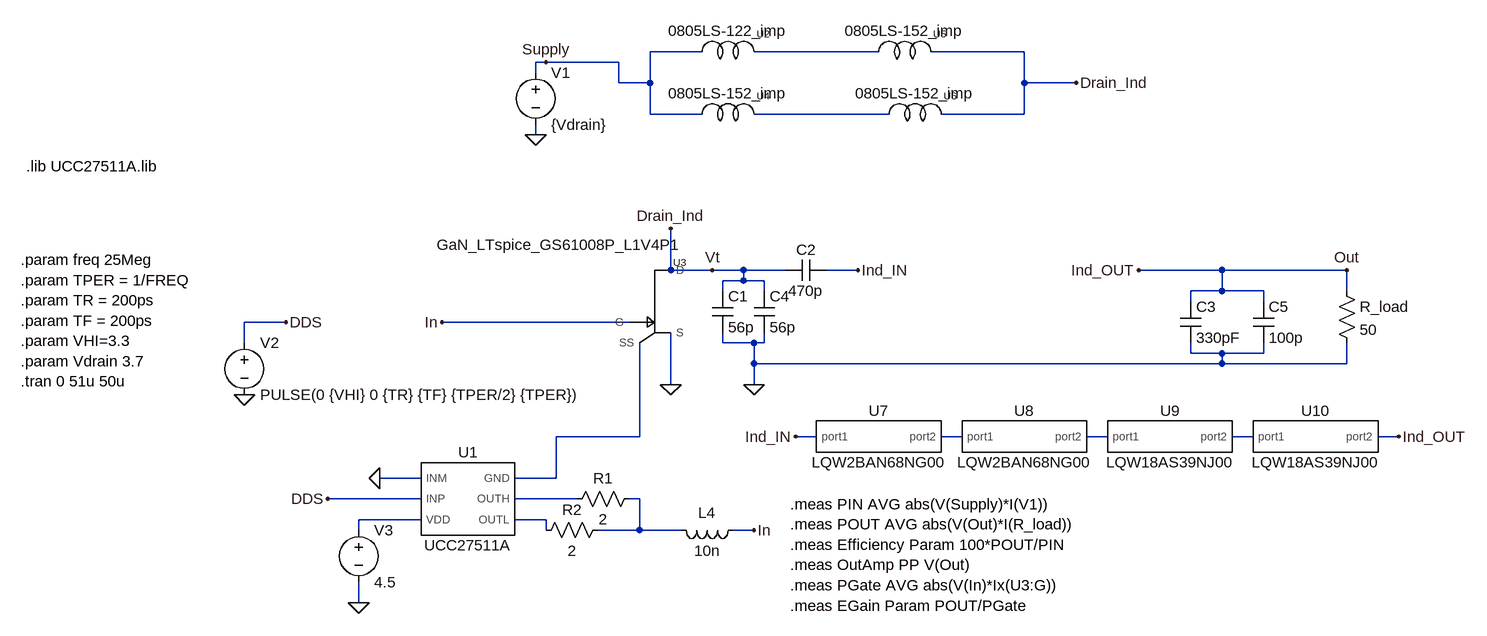
[diagram p0: schematic Class_E_TB.asc]
Class_E_TB.asc, the LTspice schematic file:
Version 4.1
SHEET 1 1384 800
WIRE 192 -208 112 -208
WIRE 464 -208 272 -208
WIRE 688 -208 544 -208
WIRE -48 -192 -64 -192
WIRE 64 -192 -48 -192
WIRE -64 -176 -64 -192
WIRE 64 -160 64 -192
WIRE 112 -160 112 -208
WIRE 112 -160 64 -160
WIRE 688 -160 688 -208
WIRE 768 -160 688 -160
WIRE 112 -112 112 -160
WIRE 192 -112 112 -112
WIRE 480 -112 272 -112
WIRE 688 -112 688 -160
WIRE 688 -112 560 -112
WIRE -64 -80 -64 -96
WIRE 144 128 144 64
WIRE 208 128 144 128
WIRE 256 128 208 128
WIRE 320 128 256 128
WIRE 432 128 384 128
WIRE 992 128 864 128
WIRE 1184 128 992 128
WIRE 256 144 256 128
WIRE 256 144 224 144
WIRE 288 144 256 144
WIRE 224 160 224 144
WIRE 288 160 288 144
WIRE 992 160 992 128
WIRE 992 160 944 160
WIRE 1056 160 992 160
WIRE 1184 160 1184 128
WIRE 944 176 944 160
WIRE 1056 176 1056 160
WIRE -448 208 -512 208
WIRE 80 208 -208 208
WIRE -512 240 -512 208
WIRE 224 240 224 224
WIRE 272 240 224 240
WIRE 288 240 288 224
WIRE 288 240 272 240
WIRE 944 256 944 240
WIRE 992 256 944 256
WIRE 1056 256 1056 240
WIRE 1056 256 992 256
WIRE 272 272 272 240
WIRE 992 272 992 256
WIRE 992 272 272 272
WIRE 1184 272 1184 240
WIRE 1184 272 992 272
WIRE 144 304 144 224
WIRE 272 304 272 272
WIRE 96 384 96 240
WIRE 96 384 -32 384
WIRE 368 384 336 384
WIRE 592 384 560 384
WIRE 816 384 784 384
WIRE 1040 384 1008 384
WIRE 1264 384 1232 384
WIRE -240 448 -304 448
WIRE -32 448 -32 384
WIRE -32 448 -96 448
WIRE -240 480 -384 480
WIRE 0 480 -96 480
WIRE 96 480 80 480
WIRE -240 512 -336 512
WIRE -48 512 -96 512
WIRE -336 528 -336 512
WIRE -48 528 -48 512
WIRE 96 528 96 480
WIRE 96 528 32 528
WIRE 160 528 96 528
WIRE 272 528 240 528
WIRE -336 640 -336 608
FLAG -64 -80 0
FLAG -512 320 0
FLAG 272 304 0
FLAG -208 208 In
FLAG 208 128 Vt
FLAG -48 -192 Supply
FLAG 144 304 0
FLAG 1184 128 Out
FLAG -448 208 DDS
FLAG -304 448 0
FLAG -384 480 DDS
FLAG 272 528 In
FLAG -336 640 0
FLAG 768 -160 Drain_Ind
FLAG 144 64 Drain_Ind
FLAG 336 384 Ind_IN
FLAG 1264 384 Ind_OUT
FLAG 432 128 Ind_IN
FLAG 864 128 Ind_OUT
SYMBOL voltage -64 -192 R0
WINDOW 123 0 0 Left 0
WINDOW 39 0 0 Left 0
SYMATTR InstName V1
SYMATTR Value {Vdrain}
SYMBOL voltage -512 224 R0
WINDOW 123 0 0 Left 0
WINDOW 39 0 0 Left 0
SYMATTR InstName V2
SYMATTR Value PULSE(0 {VHI} 0 {TR} {TF} {TPER/2} {TPER})
SYMBOL cap 384 112 R90
WINDOW 0 0 32 VBottom 2
WINDOW 3 32 32 VTop 2
SYMATTR InstName C2
SYMATTR Value 470p
SYMATTR SpiceLine V=50 Irms=2.20811 Rser=0.0430702 Lser=294.083p mfg="Vishay" pn="VJ0603D471KXXAJ" type="COG"
SYMBOL cap 208 160 R0
SYMATTR InstName C1
SYMATTR Value 56p
SYMATTR SpiceLine V=50 Irms=0 Rser=0 Lser=0
SYMBOL cap 928 176 R0
SYMATTR InstName C3
SYMATTR Value 330pF
SYMATTR SpiceLine V=50V
SYMBOL res 1168 144 R0
SYMATTR InstName R_load
SYMATTR Value 50
SYMBOL UCC27511A -176 480 R0
SYMATTR InstName U1
SYMBOL voltage -336 512 R0
WINDOW 123 0 0 Left 0
WINDOW 39 0 0 Left 0
SYMATTR InstName V3
SYMATTR Value 4.5
SYMBOL res 96 464 R90
WINDOW 0 0 56 VBottom 2
WINDOW 3 32 56 VTop 2
SYMATTR InstName R1
SYMATTR Value 2
SYMBOL res 48 512 R90
WINDOW 0 0 56 VBottom 2
WINDOW 3 32 56 VTop 2
SYMATTR InstName R2
SYMATTR Value 2
SYMBOL ind 256 512 R90
WINDOW 0 5 56 VBottom 2
WINDOW 3 32 56 VTop 2
SYMATTR InstName L4
SYMATTR Value 10n
SYMBOL GaN_LTspice_GS61008P_L1V4P1 96 176 R0
SYMATTR InstName U3
SYMBOL cap 272 160 R0
SYMATTR InstName C4
SYMATTR Value 56p
SYMATTR SpiceLine V=50 Irms=0 Rser=0 Lser=0
SYMBOL cap 1040 176 R0
SYMATTR InstName C5
SYMATTR Value 100p
SYMATTR SpiceLine V=50 Irms=20.8m Rser=5.448 Lser=0 mfg="KEMET" pn="C0603C101K5RAC" type="X7R"
SYMBOL LQW2BAN68NG00 464 384 R0
SYMATTR InstName U7
SYMBOL LQW2BAN68NG00 688 384 R0
SYMATTR InstName U8
SYMBOL LQW18AS39NJ00 912 384 R0
SYMATTR InstName U9
SYMBOL LQW18AS39NJ00 1136 384 R0
SYMATTR InstName U10
SYMBOL Coilcraft\\0805LS 192 -208 R0
SYMATTR SpiceModel 0805LS-122_imp
SYMATTR InstName U2
SYMBOL Coilcraft\\0805LS 192 -112 R0
SYMATTR SpiceModel 0805LS-152_imp
SYMATTR InstName U4
SYMBOL Coilcraft\\0805LS 464 -208 R0
SYMATTR SpiceModel 0805LS-152_imp
SYMATTR InstName U5
SYMBOL Coilcraft\\0805LS 480 -112 R0
SYMATTR SpiceModel 0805LS-152_imp
SYMATTR InstName U6
TEXT -856 112 Left 2 !.param freq 25Meg\n.param TPER = 1/FREQ\n.param TR = 200ps\n.param TF = 200ps\n.param VHI=3.3\n.param Vdrain 3.7\n.tran 0 51u 50u
TEXT 328 488 Left 2 !.meas PIN AVG abs(V(Supply)*I(V1))\n.meas POUT AVG abs(V(Out)*I(R_load))\n.meas Efficiency Param 100*POUT/PIN\n.meas OutAmp PP V(Out)\n.meas PGate AVG abs(V(In)*Ix(U3:G))\n.meas EGain Param POUT/PGate
TEXT -848 -32 Left 2 !.lib UCC27511A.lib

The netlist it stands for:
* Class_E_TB.asc
V1 Supply 0 {Vdrain}
V2 DDS 0 PULSE(0 {VHI} 0 {TR} {TF} {TPER/2} {TPER})
C2 Ind_IN Drain_Ind 470p V=50 Irms=2.20811 Rser=0.0430702 Lser=294.083p mfg="Vishay" pn="VJ0603D471KXXAJ" type="COG"
C1 Drain_Ind 0 56p V=50 Irms=0 Rser=0 Lser=0
C3 Ind_OUT 0 330pF V=50V
R_load Ind_OUT 0 50
X§U1 0 DDS N009 N003 N007 N010 UCC27511A  ; pins INM INP VDD GND OUTH OUTL
V3 N009 0 4.5
R1 N008 N007 2
R2 N008 N010 2
L4 In N008 10n
X§U3 In Drain_Ind 0 N003 GaN_LTspice_GS61008P_L1V4P1  ; pins G D S SS
C4 Drain_Ind 0 56p V=50 Irms=0 Rser=0 Lser=0
C5 Ind_OUT 0 100p V=50 Irms=20.8m Rser=5.448 Lser=0 mfg="KEMET" pn="C0603C101K5RAC" type="X7R"
X§U7 Ind_IN N004 LQW2BAN68NG00  ; pins port1 port2
X§U8 N004 N005 LQW2BAN68NG00  ; pins port1 port2
X§U9 N005 N006 LQW18AS39NJ00  ; pins port1 port2
X§U10 N006 Ind_OUT LQW18AS39NJ00  ; pins port1 port2
X§U2 Supply N001 0805LS-122_imp  ; pins port1 port2
X§U4 Supply N002 0805LS-152_imp  ; pins port1 port2
X§U5 N001 Drain_Ind 0805LS-152_imp  ; pins port1 port2
X§U6 N002 Drain_Ind 0805LS-152_imp  ; pins port1 port2
.param freq 25Meg
.param TPER = 1/FREQ
.param TR = 200ps
.param TF = 200ps
.param VHI=3.3
.param Vdrain 3.7
.tran 0 51u 50u
.meas PIN AVG abs(V(Supply)*I(V1))
.meas POUT AVG abs(V(Out)*I(R_load))
.meas Efficiency Param 100*POUT/PIN
.meas OutAmp PP V(Out)
.meas PGate AVG abs(V(In)*Ix(U3:G))
.meas EGain Param POUT/PGate
.lib UCC27511A.lib
.lib UCC27511A.lib
.lib GaN_LTspice_GS61008P_L1V4P1.lib
.lib LQW2BAN68NG00.mod
.lib LQW18AS39NJ00.mod
.lib 0805LS.lib
.backanno
.end